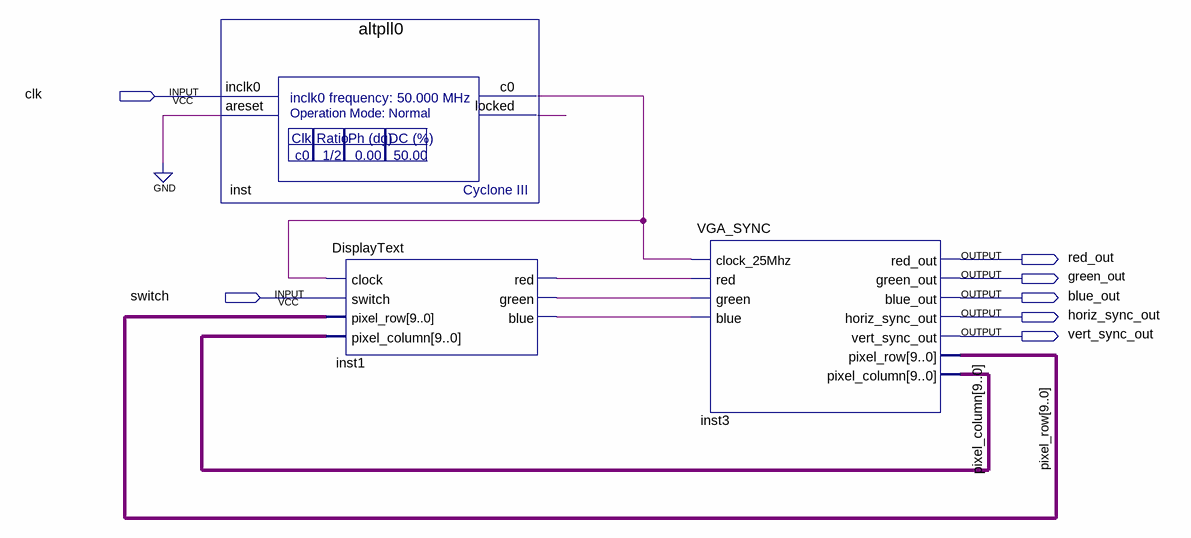
[diagram p0: schematic sheet]
// Quartus schematic TestVGA.bdf as structural Verilog: 3 symbols, 7 pins
module TestVGA (
  input  clk,
  input  switch,
  output red_out,
  output green_out,
  output blue_out,
  output horiz_sync_out,
  output vert_sync_out
);

  wire inst1_blue, inst1_green, inst1_red, inst_c0, inst_locked;
  wire [9:0] pixel_column, pixel_row;

  altpll0 inst (.inclk0(clk), .areset(1'b0), .c0(inst_c0), .locked(inst_locked));
  DisplayText inst1 (
    .clock(inst_c0), .switch(switch), .pixel_row(pixel_row), .pixel_column(pixel_column), .red(inst1_red),
    .green(inst1_green), .blue(inst1_blue));
  VGA_SYNC inst3 (
    .clock_25Mhz(inst_c0), .red(inst1_red), .green(inst1_green), .blue(inst1_blue), .red_out(red_out),
    .green_out(green_out), .blue_out(blue_out), .horiz_sync_out(horiz_sync_out),
    .vert_sync_out(vert_sync_out), .pixel_row(pixel_row), .pixel_column(pixel_column));
endmodule
